# Altium project DTCP v1.2.PrjPcb
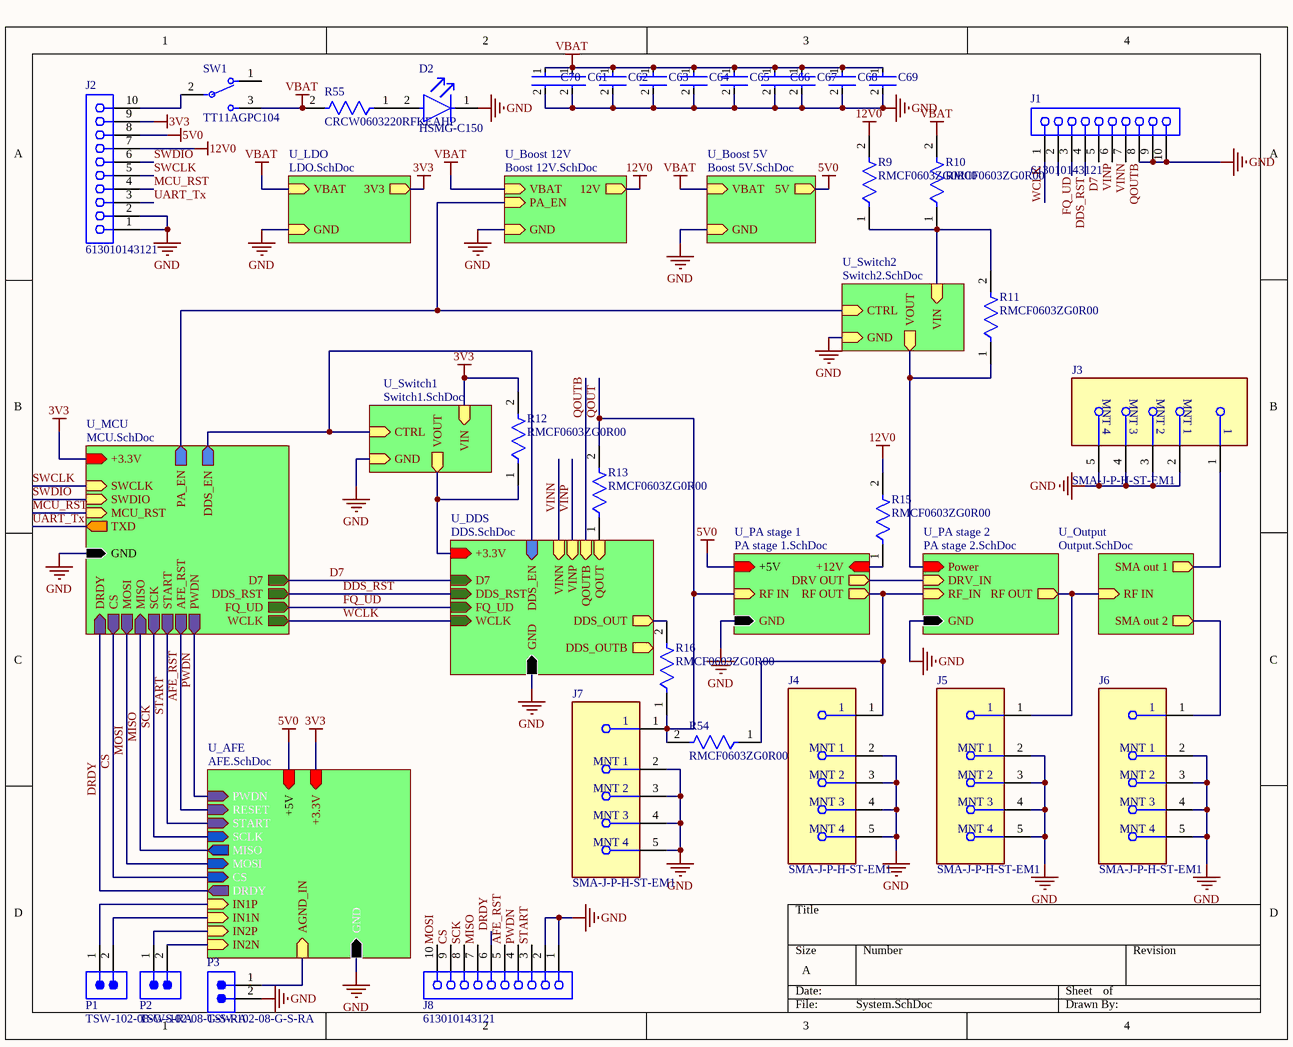
[diagram p0: System.SchDoc]
6 sheets, 92 parts. Net scope: hierarchical (ports join the sheet entries above them; power ports are global).
Board file: PCB1.PcbDoc
Sheets:
  System.SchDoc
    U_PA stage 1 = PA stage 1.SchDoc
    U_PA stage 2 = PA stage 2.SchDoc
    U_LDO = LDO.SchDoc
    U_Switch1 = Switch1.SchDoc
    U_Boost 5V = Boost 5V.SchDoc

## Sheet System.SchDoc
size A; SheetNumber: 1; SheetTotal: 12

### Parts
C61  GRM21BR60J107ME15K  [FP-GRM21B-0_2-e0_2_0_7-IPC_B]  (value not drawn)
C62  GRM21BR60J107ME15K  [FP-GRM21B-0_2-e0_2_0_7-IPC_B]  (value not drawn)
C63  GRM21BR60J107ME15K  [FP-GRM21B-0_2-e0_2_0_7-IPC_B]  (value not drawn)
C64  GRM21BR60J107ME15K  [FP-GRM21B-0_2-e0_2_0_7-IPC_B]  (value not drawn)
C65  GRM21BR60J107ME15K  [FP-GRM21B-0_2-e0_2_0_7-IPC_B]  (value not drawn)
C66  GRM21BR60J107ME15K  [FP-GRM21B-0_2-e0_2_0_7-IPC_B]  (value not drawn)
C67  GRM21BR60J107ME15K  [FP-GRM21B-0_2-e0_2_0_7-IPC_B]  (value not drawn)
C68  GRM21BR60J107ME15K  [FP-GRM21B-0_2-e0_2_0_7-IPC_B]  (value not drawn)
C69  GRM21BR60J107ME15K  [FP-GRM21B-0_2-e0_2_0_7-IPC_B]  (value not drawn)
C70  GRM21BR60J107ME15K  [FP-GRM21B-0_2-e0_2_0_7-IPC_B]  (value not drawn)
D2  HSMG-C150  [FP-HSMG-C150-MFG]
J1  613010143121  [613010143121]
J2  613010143121  [613010143121]
J3  SMA-J-P-H-ST-EM1  [FP-SMA-J-P-H-ST-EM1-MFG]
J4  SMA-J-P-H-ST-EM1  [FP-SMA-J-P-H-ST-EM1-MFG]
J5  SMA-J-P-H-ST-EM1  [FP-SMA-J-P-H-ST-EM1-MFG]
J6  SMA-J-P-H-ST-EM1  [FP-SMA-J-P-H-ST-EM1-MFG]
J7  SMA-J-P-H-ST-EM1  [FP-SMA-J-P-H-ST-EM1-MFG]
J8  613010143121  [613010143121]
P1  TSW-102-08-G-S-RA  [SMTC-TSW-102-08-X-S-RA]
P2  TSW-102-08-G-S-RA  [SMTC-TSW-102-08-X-S-RA]
P3  TSW-102-08-G-S-RA  [SMTC-TSW-102-08-X-S-RA]
R9  RMCF0603ZG0R00  [FP-RMCF0603-IPC_B]
R10  RMCF0603ZG0R00  [FP-RMCF0603-IPC_B]
R11  RMCF0603ZG0R00  [FP-RMCF0603-IPC_B]
R12  RMCF0603ZG0R00  [FP-RMCF0603-IPC_B]
R13  RMCF0603ZG0R00  [FP-RMCF0603-IPC_B]
R15  RMCF0603ZG0R00  [FP-RMCF0603-IPC_B]
R16  RMCF0603ZG0R00  [FP-RMCF0603-IPC_B]
R54  RMCF0603ZG0R00  [FP-RMCF0603-IPC_B]
R55  CRCW0603220RFKEAHP  [FP-CRCW0603-HPe3-IPC_A]
SW1  TT11AGPC104  [FP-TT11AGPC104-MFG]

### Sub-sheets
U_AFE = AFE.SchDoc (file not in this document): +5V (in), GND (in), +3.3V (in), DRDY (out), CS (in), SCLK (in), MISO (out), MOSI (in), START (in), PWDN (in), RESET (in), IN1P (in), IN1N (in), IN2P (in), IN2N (in), AGND_IN (in)
U_Boost 5V = Boost 5V.SchDoc: VBAT (in), GND (in), 5V (out)
U_Boost 12V = Boost 12V.SchDoc (file not in this document): VBAT (in), GND (in), 12V (out), PA_EN (in)
U_DDS = DDS.SchDoc (file not in this document): DDS_OUTB (out), DDS_OUT (out), D7 (in), DDS_RST (in), FQ_UD (in), WCLK (in), +3.3V (in), GND (in), DDS_EN (in), VINN (in), VINP (in), QOUTB (in), QOUT (in)
U_LDO = LDO.SchDoc: VBAT (in), GND (in), 3V3 (out)
U_MCU = MCU.SchDoc (file not in this document): +3.3V (in), GND (in), SWCLK (in), SWDIO (in), MCU_RST (in), TXD (out), CS (out), MOSI (out), MISO (in), SCK (out), D7 (out), DDS_RST (out), FQ_UD (out), WCLK (out), PWDN (out), START (out), AFE_RST (out), PA_EN (out), DDS_EN (out), DRDY (in)
U_Output = Output.SchDoc (file not in this document): RF IN (in), SMA out 1 (out), SMA out 2 (out)
U_PA stage 1 = PA stage 1.SchDoc: RF IN (in), RF OUT (out), +5V (in), GND (in), +12V (in), DRV OUT (out)
U_PA stage 2 = PA stage 2.SchDoc: GND (in), RF OUT (out), Power (in), RF_IN (in), DRV_IN (in)
U_Switch1 = Switch1.SchDoc: VIN (in), VOUT (out), CTRL (in), GND (in)
U_Switch2 = Switch2.SchDoc (file not in this document): VIN (in), VOUT (out), CTRL (in), GND (in)

### Nets
3V3: J2.9 R12.2 ; sheet U_MCU/+3.3V, sheet U_LDO/3V3, sheet U_Switch1/VIN, sheet U_AFE/+3.3V
5V0: J2.8 ; sheet U_PA stage 1/+5V, sheet U_Boost 5V/5V, sheet U_AFE/+5V
12V0: J2.7 R9.2 R15.2 ; sheet U_Boost 12V/12V
GND: C61.2 C62.2 C63.2 C64.2 C65.2 C66.2 C67.2 C68.2 C69.2 C70.2 D2.1(C) J1.8 J1.9 J1.10 J2.1 J2.2 J3.2(MNT_1) J3.3(MNT_2) J3.4(MNT_3) J3.5(MNT_4) J4.2(MNT_1) J4.3(MNT_2) J4.4(MNT_3) J4.5(MNT_4) J5.2(MNT_1) J5.3(MNT_2) J5.4(MNT_3) J5.5(MNT_4) J6.2(MNT_1) J6.3(MNT_2) J6.4(MNT_3) J6.5(MNT_4) J7.2(MNT_1) J7.3(MNT_2) J7.4(MNT_3) J7.5(MNT_4) J8.1 J8.2 P3.2 ; sheet U_MCU/GND, sheet U_DDS/GND, sheet U_PA stage 1/GND, sheet U_PA stage 2/GND, sheet U_LDO/GND, sheet U_Boost 12V/GND, sheet U_Switch1/GND, sheet U_Switch2/GND, sheet U_Boost 5V/GND, sheet U_AFE/GND
VBAT: C61.1 C62.1 C63.1 C64.1 C65.1 C66.1 C67.1 C68.1 C69.1 C70.1 R10.2 R55.2 SW1.3 ; sheet U_LDO/VBAT, sheet U_Boost 12V/VBAT, sheet U_Boost 5V/VBAT
AFE_RST: J8.5 ; sheet U_MCU/AFE_RST, sheet U_AFE/RESET
CS: J8.9 ; sheet U_MCU/CS, sheet U_AFE/CS
D7: J1.4 ; sheet U_MCU/D7, sheet U_DDS/D7
DDS_RST: J1.3 ; sheet U_MCU/DDS_RST, sheet U_DDS/DDS_RST
DRDY: J8.6 ; sheet U_MCU/DRDY, sheet U_AFE/DRDY
FQ_UD: J1.2 ; sheet U_MCU/FQ_UD, sheet U_DDS/FQ_UD
MCU_RST: J2.4 ; sheet U_MCU/MCU_RST
MISO: J8.7 ; sheet U_MCU/MISO, sheet U_AFE/MISO
MOSI: J8.10 ; sheet U_MCU/MOSI, sheet U_AFE/MOSI
PWDN: J8.4 ; sheet U_MCU/PWDN, sheet U_AFE/PWDN
QOUT: J7.1 R13.2 R16.1 R54.2 ; sheet U_PA stage 1/RF IN
QOUTB: J1.7 ; sheet U_DDS/QOUTB
SCK: J8.8 ; sheet U_MCU/SCK, sheet U_AFE/SCLK
START: J8.3 ; sheet U_MCU/START, sheet U_AFE/START
SWCLK: J2.5 ; sheet U_MCU/SWCLK
SWDIO: J2.6 ; sheet U_MCU/SWDIO
UART_Tx: J2.3 ; sheet U_MCU/TXD
VINN: J1.6 ; sheet U_DDS/VINN
VINP: J1.5 ; sheet U_DDS/VINP
WCLK: J1.1 ; sheet U_MCU/WCLK, sheet U_DDS/WCLK
NetC35_1: R15.1 ; sheet U_PA stage 1/+12V
NetD2_2: D2.2(A) R55.1
NetJ2_10: J2.10 SW1.2
NetJ3_1: J3.1 ; sheet U_Output/SMA out 1
NetJ4_1: J4.1 R54.1 ; sheet U_PA stage 1/RF OUT, sheet U_PA stage 2/RF_IN
NetJ5_1: J5.1 ; sheet U_PA stage 2/RF OUT, sheet U_Output/RF IN
NetJ6_1: J6.1 ; sheet U_Output/SMA out 2
NetP1_1: P1.1 ; sheet U_AFE/IN1P
NetP1_2: P1.2 ; sheet U_AFE/IN1N
NetP2_1: P2.1 ; sheet U_AFE/IN2P
NetP2_2: P2.2 ; sheet U_AFE/IN2N
NetP3_1: P3.1 ; sheet U_AFE/AGND_IN
NetQ1_2: sheet U_PA stage 1/DRV OUT, sheet U_PA stage 2/DRV_IN
NetR9_1: R9.1 R10.1 R11.2 ; sheet U_Switch2/VIN
NetR11_1: R11.1 ; sheet U_PA stage 2/Power, sheet U_Switch2/VOUT
NetR12_1: R12.1 ; sheet U_DDS/+3.3V, sheet U_Switch1/VOUT
NetR13_1: R13.1 ; sheet U_DDS/QOUT
NetR16_2: R16.2 ; sheet U_DDS/DDS_OUT
NetU3_3: sheet U_MCU/DDS_EN, sheet U_DDS/DDS_EN, sheet U_Switch1/CTRL
(unnamed): sheet U_MCU/PA_EN, sheet U_Boost 12V/PA_EN, sheet U_Switch2/CTRL

Not connected (* = marked no-connect by the designer): SW1 1

### Library data of the parts
C61-C70 = CMP-06035-052658-1: Chip Multilayer Ceramic Capacitors for General Purpose, 0805, 100uF, X5R, 15%, 20%, 6.3V; Voltage Rating (DC): 6.3V; Lead Free: Lead Free; Length: 2mm; Tolerance: 20%; Width: 1.25mm; Capacitance: 100uF; Dielectric: X5R; Thickness: 1.25mm
D2 = CMP-2000-05061-2: LED GREEN DIFFUSED 1206 SMD; Manufacturer: Broadcom; Led Orientation: Top View; Max Junction Temp: +95°C; Peak Emmision Wavelength: 570nm; Viewing Angle: 170°; Wavelength: 572nm; Reverse Voltage: 5V; Luminous Intensity: 15mcd; Forward Voltage: 2.2V; Power Dissipation: 65mW; Forward Current: 20mA; ComponentLink2Description: Datasheet; Lead Free: Yes; Temperature Range Low: -40°C; Package: HSMG-C150; Digikey Description: LED GREEN DIFFUSED 1206 SMD; Mouser Description: LED Uni-Color Green 570nm 2-Pin Chip LED T/R; Manufacturer Part Number: HSMG-C150; Temperature Range High: +85°C; Device Class L1: Optoelectronics; Colour: Green; Category: Diode; Device Class L3: unset; RoHS: TRUE; Height: 1.2mm; ComponentLink2URL: https://docs.broadcom.com/docs/AV02-0551EN; Device Class L2: LEDs; Automotive: No; Ipc Land Pattern Name: DIOCP320160X55; Octopart: https://octopart.com/hsmg-c150-broadcom-71131304; Temperature: -40°C to +85°C
J1 J2 J8 = CMP-1502-01419-3: NexarPartId: 18818161; Operating Supply Voltage: 250V; Contact Resistance: 20mΩ; Gender: Female; Insulation Resistance: 1GΩ; Connector Type: Header, Socket; Insulation: Insulated; Current Rating: 3A; Number of Positions: 10; Pitch: 2.54mm; Number of Rows: 1; Number of Pins: 10; Voltage Rating: 250V; Length: 25.9mm; Contact Gender: Female; RoHS: Compliant; Contact Plating: Gold; Height: 8.5mm; Min Operating Temperature: -40°C; Contact Material: Copper; Number of Contacts: 10; REACH SVHC: Unknown; Mount: Through Hole; Lead Pitch: 2.54mm; Width: 25.9mm; Max Operating Temperature: 125°C; Flammability Rating: UL94 V-0; Termination: Through Hole; Color: Black; Housing Material: PBT
J3-J7 = CMP-02754-000006-1: CONN SMA JACK STR 50OHM EDGE MNT; Dielectric Material: PTFE; Center Contact Plating: Gold; Max Frequency: 6GHz; Body Material: Brass; Voltage Rating: 335V; Impedance: 50R; Package Quantity: 1; Case/Package: SMA; Max Operating Temperature: 125°C; Fastening Type: Threaded; Orientation: Straight; Depth: 13.33mm; RoHS Compliant: Yes; Length: 6.35mm; Insulation Material: Polytetrafluoroethylene; Termination: Solder; Min Operating Temperature: -65°C; Housing Color: Gold; Contact Plating: Gold; Contact Material: Copper; Connector Type: SMA; Mount: Edge; Series: SMA; Packaging: Tray; Body Plating: Gold; Radiation Hardening: No
P1-P3 = CMP-1024-00320-1: 0.025" SQ Post Header, Through-hole, Right Angle, -55 to 125 degC, 2.54 mm Pitch, 2-Pin, Male, RoHS; Manufacturer: Samtec; Pitch: 2.54 mm; Temperature Range: -55 to 125 degC; PackageDescription: .025[0.64] SQ. Post Terminal Strip Assembly; ComponentLink3Description: Package Specification; ComponentLink2Description: Datasheet; PackageReference: TSW-102-08-X-S-RA; ComponentLink1Description: Manufacturer URL; ComponentLink2URL: http://www.samtec.com/documents/webfiles/pdf/TSW_TH.PDF; PackageVersion: DM, 8/1988; RoHS: True; PartNumber: TSW-102-08-G-S-RA; Mounting Technology: Through-hole; Orientation: Right Angle; ComponentLink1URL: http://www.samtec.com; DatasheetVersion: F-214; ComponentLink3URL: http://www.samtec.com/documents/webfiles/cpdf/TSW-XXX-XX-XXX-X-XX-XXX-MKT.pdf
R9-R13 R15 R16 R54 = CMP-26527-006412-1: 0Ω ±0 0.1W 0603 Thick Film Chip Resistor AEC-Q200 compliant; Max Power Dissipation: 100mW; Resistance: 0R; Width: 0.031inch; RoHS Compliant: Yes; Number of Terminations: 2; Case/Package: 0603; Contact Plating: Tin; Height: 0.022inch; Resistor Type: Thick Film; Mount: Surface Mount; Length: 0.061inch; Features: Automotive AEC-Q200; Series: RMCF; Max Operating Temperature: 155°C; Radiation Hardening: No; Min Operating Temperature: -55°C; Packaging: Tape and Reel
R55 = CMP-02407-003593-1: RES Thick Film, 220Ω, 1%, 0.33W, 100ppm/°C, 0603; Max Power Dissipation: 250mW; Voltage Rating (DC): 75V; Resistance: 220R; Radiation Hardening: No; Contact Plating: Tin; Length: 1.6mm; Depth: 0.85mm; Composition: Thick Film; Lead Free: Lead Free; Mount: Surface Mount; Package Quantity: 5000; Height: 0.45mm; Termination: SMD/SMT; Weight: 7.1E-05oz; Military Standard: Not; Number of Terminations: 2; Case Code (Metric): 1608; Max Operating Temperature: 155°C; Power Rating: 250mW; Tolerance: 1%; Temperature Coefficient: 100ppm/°C; Features: Automotive AEC-Q200; Case Code (Imperial): 0603; Width: 0.033inch; Min Operating Temperature: -55°C; Case/Package: 0603; Voltage Rating: 75V; Packaging: Tape and Reel
SW1 = CMP-03408-000020-1: SWITCH TOGGLE SPST 0.4VA 20V; Illumination Type: Illuminated; Actuator Length: 5.61mm; Contact Current Rating: 3A; Power Rating: 400mW; Voltage Rating (AC): 20V; Packaging: Bulk; Max Voltage Rating (DC): 20V; Actuator Type: Toggle; Orientation: Straight; RoHS Compliant: Yes; Throw Configuration: SPST; Min Operating Temperature: -30°C; Voltage Rating (DC): 20V; Series: TT (Tiny); Contact Plating: Gold; Package Quantity: 25; Max Operating Temperature: 85°C; Mount: Brackets; Termination: PC Pins; Max Voltage Rating (AC): 20V

## Sheet PA stage 1.SchDoc
size A; SheetNumber: 8; SheetTotal: 12
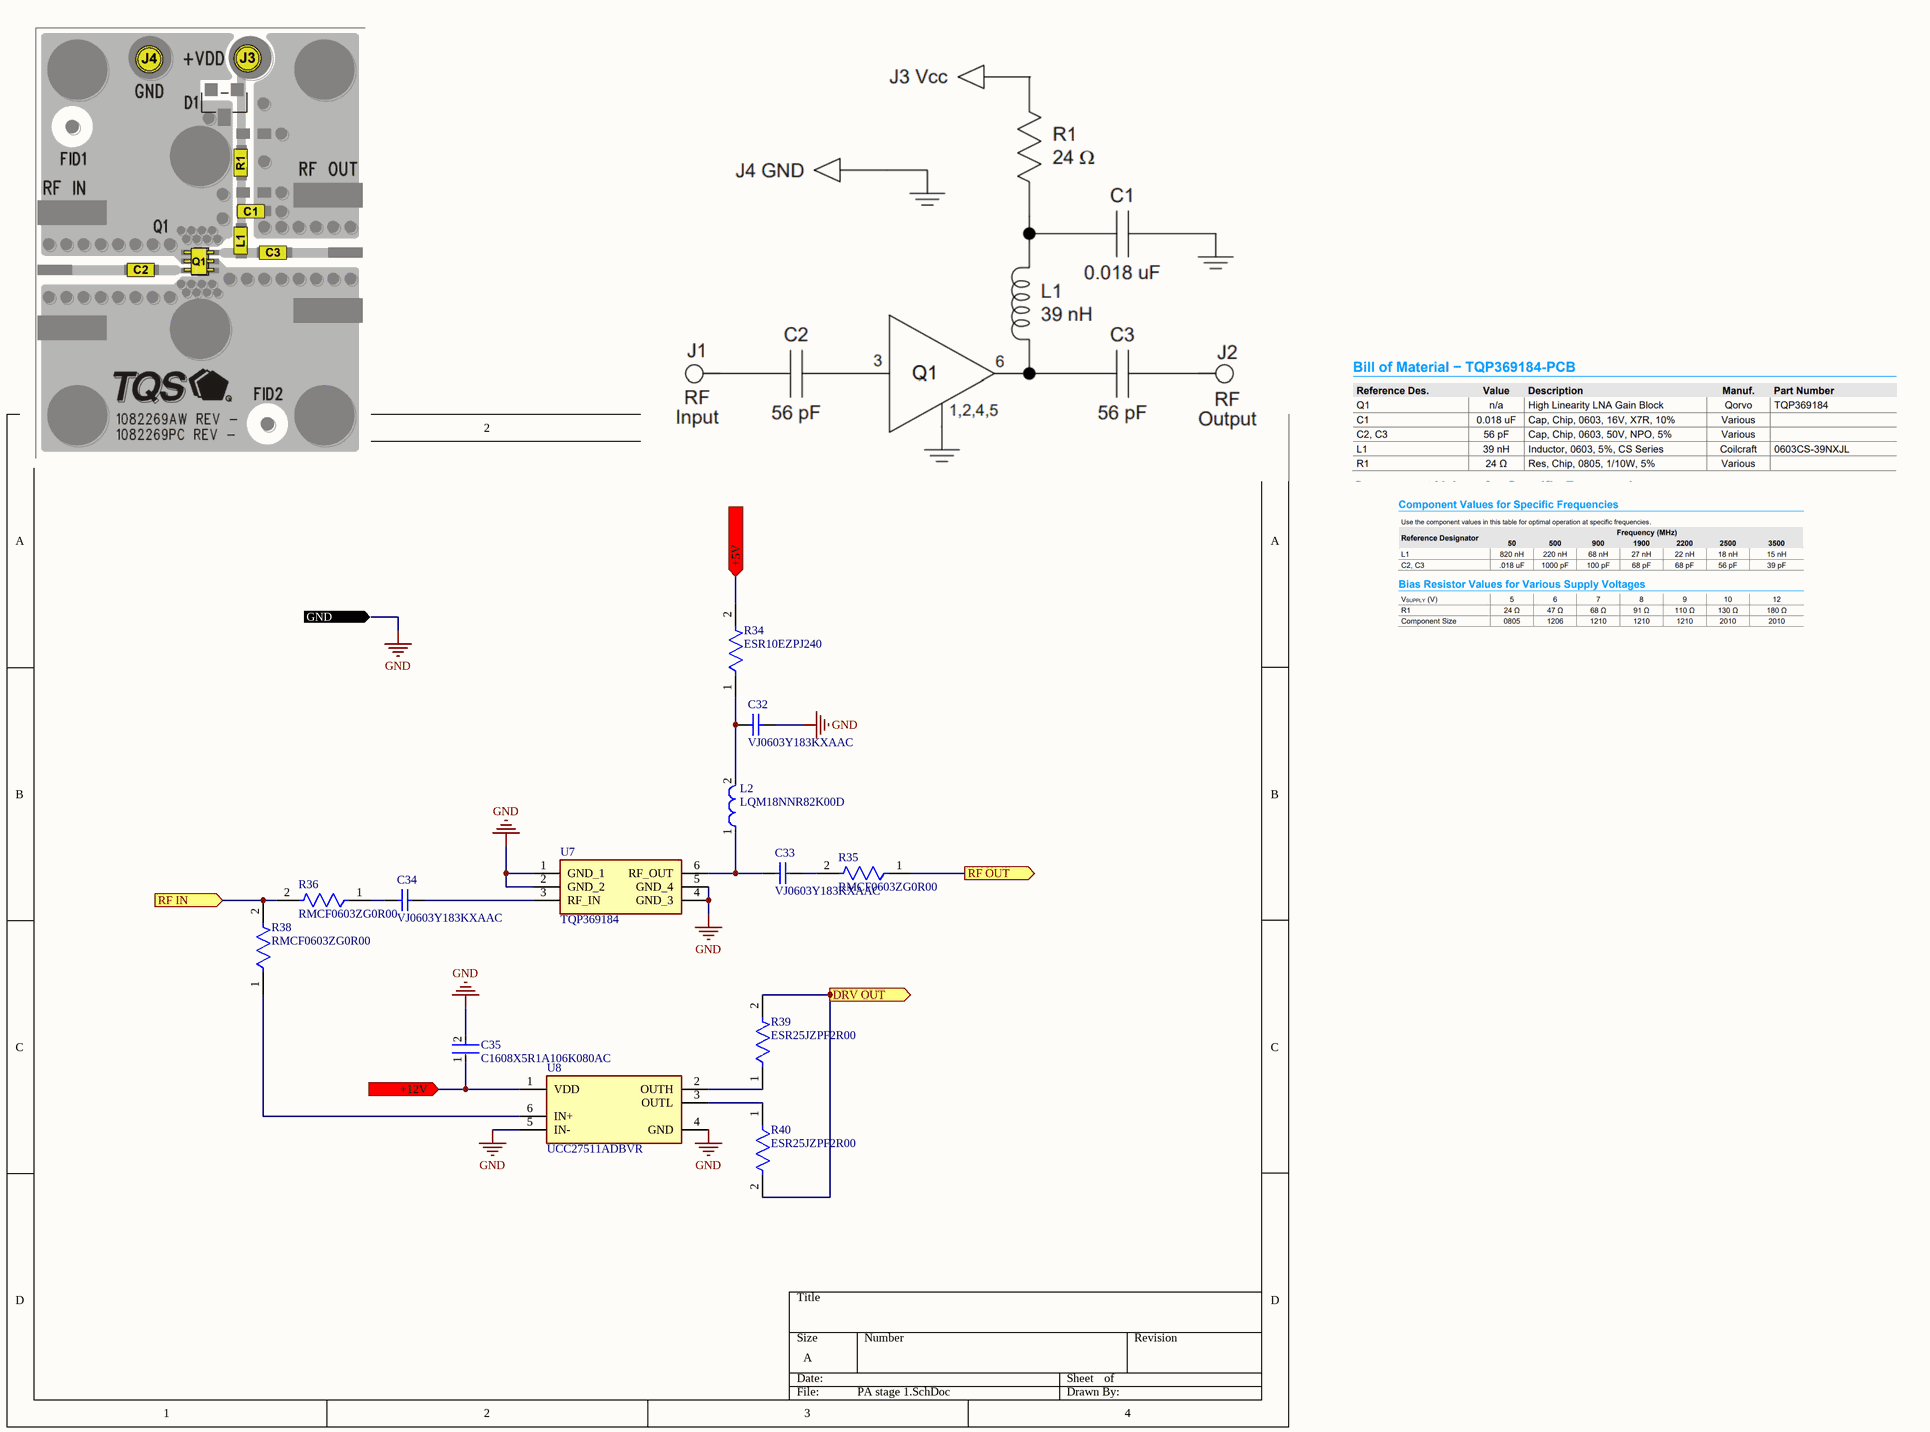
[diagram p1: PA stage 1.SchDoc]

### Parts
C32  VJ0603Y183KXAAC  [CAPC1608X92X38ML15T08]
C33  VJ0603Y183KXAAC  [CAPC1608X92X38ML15T08]
C34  VJ0603Y183KXAAC  [CAPC1608X92X38ML15T08]
C35  C1608X5R1A106K080AC  [FP-C1608-080-0_1-MFG]
L2  LQM18NNR82K00D  [FP-LQM18NN_00-IPC_B]
R34  ESR10EZPJ240  [FP-ESR10-IPC_C]
R35  RMCF0603ZG0R00  [FP-RMCF0603-IPC_B]
R36  RMCF0603ZG0R00  [FP-RMCF0603-IPC_B]
R38  RMCF0603ZG0R00  [FP-RMCF0603-IPC_B]
R39  ESR25JZPF2R00  [FP-ESR25-MFG]
R40  ESR25JZPF2R00  [FP-ESR25-MFG]
U7  TQP369184  [SOT65P210X110-6N]
U8  UCC27511ADBVR  [FP-DBV0006A-IPC_B]

### Ports
+5V (in), +12V (in), DRV OUT (out), GND (in), RF IN (in), RF OUT (out)

### Nets
5V0: R34.2 ; port +5V
GND: C32.2 C35.2 U7.1(GND_1) U7.2(GND_2) U7.4(GND_3) U7.5(GND_4) U8.4(GND) U8.5(IN-) ; port GND
QOUT: R36.2 R38.2 ; port RF IN
NetC32_1: C32.1 L2.2 R34.1
NetC33_1: C33.1 L2.1 U7.6(RF_OUT)
NetC33_2: C33.2 R35.2
NetC34_1: C34.1 R36.1
NetC34_2: C34.2 U7.3(RF_IN)
NetC35_1: C35.1 U8.1(VDD) ; port +12V
NetJ4_1: R35.1 ; port RF OUT
NetQ1_2: R39.2 R40.2 ; port DRV OUT
NetR38_1: R38.1 U8.6(IN+)
NetR39_1: R39.1 U8.2(OUTH)
NetR40_1: R40.1 U8.3(OUTL)

### Library data of the parts
C32-C34 = CMP-2006-01326-1: Manufacturer: Vitramon; Part Number: VJ0603Y183KXAAC
C35 = CMP-2000-04979-3: Multilayer Ceramic Capacitors 10μF ±10% 10V X5R SMD 0603; Capacitance: 10uF; Dielectric Material: Ceramic; Construction: Flat; Height: 0.8mm; Thickness: 0.035inch; Case Code (Metric): 1608; Radiation Hardening: No; Number of Pins: 2; Voltage Rating (DC): 10V; Depth: 0.8mm; Voltage: 10V; RoHS Compliant: Yes; Voltage Rating: 10V; Package Quantity: 1; Resistor Type: Ceramic; Termination: SMD/SMT; Lead Free: Lead Free; REACH SVHC: No SVHC; Tolerance: 10%; Mount: Surface Mount; Series: C; Packaging: Tape and Reel; Width: 0.8mm; Dielectric: X5R; Weight: 7.1E-05oz; Length: 1.6mm; Max Operating Temperature: 85°C; Case Code (Imperial): 0603; Case/Package: 0603; Min Operating Temperature: -55°C
L2 = CMP-06042-016197-1: Multilayer Type Inductor for General Circuits, 0603 (1608), 820nH, 10%, 2.1Ω, 35mA; Self Resonant Frequency: 85MHz; Shielding: Shielded; DC Resistance (DCR): 2.1R; Test Frequency: 25MHz; Core Material: Ferrite; Q Factor: 15; RoHS Compliant: Yes; Length: 1.6mm; Max Operating Temperature: 85°C; Case Code (Metric): 1608; Lead Free: Lead Free; Package Quantity: 1; Series: LQM18N; Height - Seated (Max): 0.037inch; Current Rating: 35mA; Radiation Hardening: No; REACH SVHC: No SVHC; Termination: SMD/SMT; Case Code (Imperial): 0603; Width: 0.031inch; Height: 0.8mm; Tolerance: 10%; Military Standard: Not; Mount: Surface Mount; Max DC Current: 35mA; Depth: 0.95mm; Inductance: 820nH; Min Operating Temperature: -40°C; DC Current: 35mA; Case/Package: 0603; Packaging: Tape and Reel
R34 = CMP-08839-028611-1: 24Ω ±5% 0.4W 0805 Anti-Surge Chip Resistor AEC-Q200; Temperature Coefficient: 200ppm/°C; Resistance: 24R; Max Power Dissipation: 400mW; Tolerance: 5%; RoHS Compliant: Yes; Max Operating Temperature: 155°C; Min Operating Temperature: -55°C; Resistor Type: Thick Film; Width: 0.049inch; Length: 0.079inch; Number of Terminations: 2; Height: 0.026inch; Case Code (Imperial): 0805; Series: ESR; Case/Package: 0805; Case Code (Metric): 2012; Packaging: Tape and Reel; Features: Automotive AEC-Q200; Package Quantity: 1
R35 R36 R38 = CMP-26527-006412-1: as R9 on sheet System; Width: 0.031inch; RoHS Compliant: Yes; Number of Terminations: 2; Case/Package: 0603; Contact Plating: Tin; Height: 0.022inch; Resistor Type: Thick Film; Mount: Surface Mount; Length: 0.061inch; Features: Automotive AEC-Q200; Series: RMCF; Max Operating Temperature: 155°C; Radiation Hardening: No; Min Operating Temperature: -55°C; Packaging: Tape and Reel
R39 R40 = CMP-08839-008954-1: 2Ω ±1% 0.66W 1210 Anti-Surge Chip Resistor AEC-Q200; Temperature Coefficient: 100ppm/°C; Resistance: 2R; Power Rating: 500mW; Series: ESR; RoHS Compliant: Yes; Number of Terminations: 2; Length: 0.126inch; Case/Package: 1210; Min Operating Temperature: -55°C; Width: 0.098inch; Lead Free: Lead Free; Packaging: Tape and Reel; Features: Automotive AEC-Q200; Height: 0.026inch; Case Code (Imperial): 1210; Case Code (Metric): 3225; Size Code: 1210; Package Quantity: 1; Max Operating Temperature: 155°C; Resistor Type: Thick Film; Max Power Dissipation: 500mW; Tolerance: 1%
U7 = TQP369184: DC  6 GHz Gain Block; Manufacturer_Name: Qorvo; Geometry.Height: 1.1mm; Mouser Part Number: 772-TQP369184; Mouser Price/Stock: https://www.mouser.co.uk/ProductDetail/Qorvo/TQP369184?qs=opBjA1TV900HByuIeJCWsQ%3D%3D; Manufacturer_Part_Number: TQP369184; Datasheet Link: https://www.qorvo.com/products/d/da005471
U8 = CMP-04912-000035-1: IC GATE DRVR LOW-SIDE SOT23-6; Number of Drivers: 1; Max Output Current: 8A; Channel Type: Single; Case/Package: SOT-23-6; Mount: Surface Mount; Max Operating Temperature: 140°C; Packaging: Tape and Reel; Min Operating Temperature: -40°C; RoHS Compliant: Yes; Number of Channels: 1

## Sheet PA stage 2.SchDoc
size A; SheetNumber: 9; SheetTotal: 12
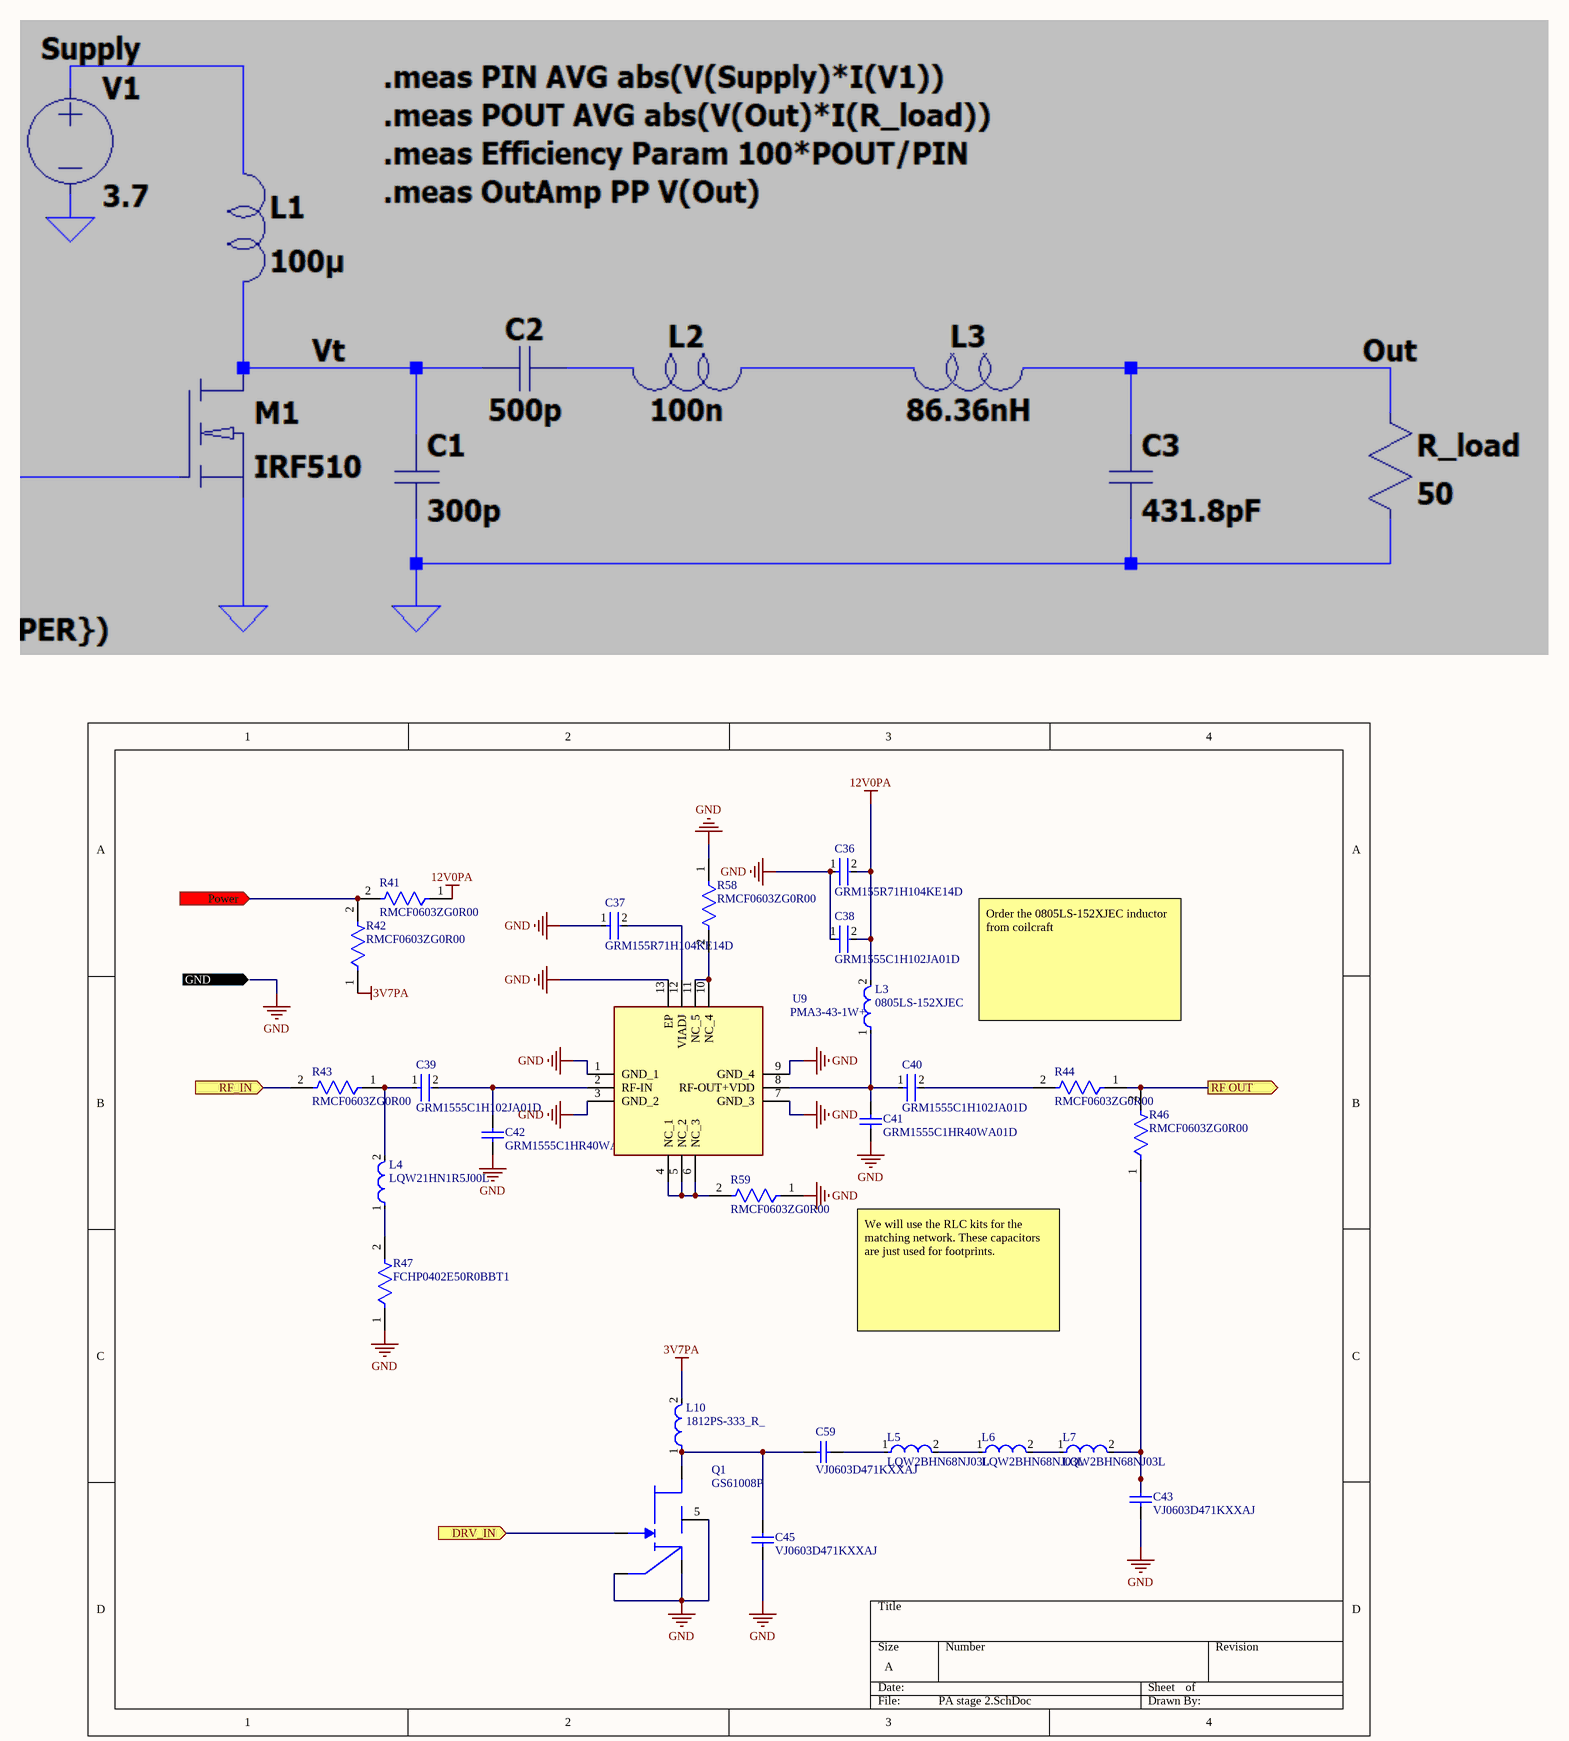
[diagram p2: PA stage 2.SchDoc]

### Parts
C36  GRM155R71H104KE14D  [FP-GRM155-0_05-IPC_B]
C37  GRM155R71H104KE14D  [FP-GRM155-0_05-IPC_B]
C38  GRM1555C1H102JA01D  [FP-GRM155-0_05-IPC_B]
C39  GRM1555C1H102JA01D  [FP-GRM155-0_05-IPC_B]
C40  GRM1555C1H102JA01D  [FP-GRM155-0_05-IPC_B]
C41  GRM1555C1HR40WA01D  [CAPC1005X55X25LL05T10]
C42  GRM1555C1HR40WA01D  [CAPC1005X55X25LL05T10]
C43  VJ0603D471KXXAJ  [CAPC1608X92X38LL15T08]
C45  VJ0603D471KXXAJ  [CAPC1608X92X38LL15T08]
C59  VJ0603D471KXXAJ  [CAPC1608X92X38LL15T08]
L3  0805LS-152XJEC  [FP-LQW21HN_00-MFG]
L4  LQW21HN1R5J00L  [FP-LQW21HN_00-MFG]
L5  LQW2BHN68NJ03L  [FP-LQW2BHN_03-MFG]
L6  LQW2BHN68NJ03L  [FP-LQW2BHN_03-MFG]
L7  LQW2BHN68NJ03L  [FP-LQW2BHN_03-MFG]
L10  1812PS-333_R_  [FP-1812PS-MFG]
Q1  GS61008P  [TRANS_GS61008P]
R41  RMCF0603ZG0R00  [FP-RMCF0603-IPC_B]
R42  RMCF0603ZG0R00  [FP-RMCF0603-IPC_B]
R43  RMCF0603ZG0R00  [FP-RMCF0603-IPC_B]
R44  RMCF0603ZG0R00  [FP-RMCF0603-IPC_B]
R46  RMCF0603ZG0R00  [FP-RMCF0603-IPC_B]
R47  FCHP0402E50R0BBT1  [FP-FC0402-MFG]
R58  RMCF0603ZG0R00  [FP-RMCF0603-IPC_B]
R59  RMCF0603ZG0R00  [FP-RMCF0603-IPC_B]
U9  PMA3-43-1W+  [QFN51P300X300X89-13N]

### Ports
DRV_IN (in), GND (in), Power (in), RF OUT (out), RF_IN (in)

### Nets
3V7PA: L10.2 R42.1
12V0PA: C36.2 C38.2 L3.2 R41.1
GND: C36.1 C37.1 C38.1 C41.1 C42.1 C43.1 C45.1 Q1.3(SS) Q1.4(S) Q1.5(THERMAL_PAD) R47.1 R58.1 R59.1 U9.1(GND_1) U9.3(GND_2) U9.7(GND_3) U9.9(GND_4) U9.13(EP) ; port GND
NetC37_2: C37.2 U9.12(VIADJ)
NetC39_1: C39.1 L4.2 R43.1
NetC39_2: C39.2 C42.2 U9.2(RF-IN)
NetC40_1: C40.1 C41.2 L3.1 U9.8(RF-OUT+VDD)
NetC40_2: C40.2 R44.2
NetC43_2: C43.2 L7.2 R46.1
NetC45_2: C45.2 C59.2 L10.1 Q1.1(D)
NetC59_1: C59.1 L5.1
NetJ4_1: R43.2 ; port RF_IN
NetJ5_1: R44.1 R46.2 ; port RF OUT
NetL4_1: L4.1 R47.2
NetL5_2: L5.2 L6.1
NetL6_2: L6.2 L7.1
NetQ1_2: Q1.2(G) ; port DRV_IN
NetR11_1: R41.2 R42.2 ; port Power
NetR58_2: R58.2 U9.10(NC_4) U9.11(NC_5)
NetR59_2: R59.2 U9.4(NC_1) U9.5(NC_2) U9.6(NC_3)

### Notes on the sheet
- Order the 0805LS-152XJEC inductor from coilcraft
- We will use the RLC kits for the matching network. These capacitors are just used for footprints.

### Library data of the parts
C36 C37 = CMP-2008-04639-2: Chip Multilayer Ceramic Capacitors for General Purpose, 0402, 0.10uF, X7R, 15%, 10%, 50V; Dissipation Factor: 0.025%; Capacitance: 100nF; Weight: 0.000212oz; Thickness: 0.022inch; Voltage Rating (DC): 50V; Dielectric Material: Ceramic; Termination: SMD/SMT; Case/Package: 0402; Case Code (Imperial): 0402; Mount: Surface Mount; REACH SVHC: No SVHC; Resistor Type: Ceramic; Dielectric: X7R; Max Operating Temperature: 125°C; Voltage: 50V; Lead Free: Lead Free; Package Quantity: 10000; Packaging: Tape and Reel; Length: 1mm; Material: Ceramic; Height: 0.5mm; Depth: 0.5mm; Width: 0.5mm; Min Operating Temperature: -55°C; Tolerance: 10%; Case Code (Metric): 1005; Voltage Rating: 50V
C38-C40 = CMP-2008-04254-2: Chip Multilayer Ceramic Capacitors for General Purpose, 0402, 1000pF, C0G, 30ppm/°C, 5%, 50V; Insulation Resistance: 10GR; Capacitance: 1nF; Packaging: Tape and Reel; Lead Free: Lead Free; Tolerance: 5%; Temperature Coefficient: 30ppm/°C; Thickness: 0.022inch; Termination: SMD/SMT; Max Operating Temperature: 125°C; Height: 0.5mm; Package Quantity: 1; Radiation Hardening: No; Material: Ceramic; Case Code (Metric): 1005; Number of Pins: 2; Voltage Rating: 50V; Mount: Surface Mount; Voltage: 50V; Case/Package: 0402; Min Operating Temperature: -55°C; Dielectric Material: Ceramic; Width: 0.5mm; Depth: 0.5mm; Case Code (Imperial): 0402; REACH SVHC: No SVHC; Dielectric: C0G; Voltage Rating (DC): 50V; Length: 1mm
C41 C42 = CMP-1034-00010-2: Manufacturer: Murata; Part Number: GRM1555C1HR40WA01D
C43 C45 C59 = CMP-2006-01521-1: Manufacturer: Vitramon; Part Number: VJ0603D471KXXAJ
L3 = CMP-06042-001639-1: 0805LS-152XJEC Coilcraft; Core Material: Ferrite; DC Current: 85mA; DC Resistance (DCR): 5.33R; Self Resonant Frequency: 350MHz; Shielding: Unshielded; Inductance: 1.5uH; Test Frequency: 10MHz; Tolerance: 5%; Q Factor: 35; Width: 0.047inch; Case Code (Metric): 2012; Current Rating: 85mA; Mount: Surface Mount; Max DC Current: 85mA; Length: 2mm; Height - Seated (Max): 0.039inch; Depth: 1.4mm; Min Operating Temperature: -40°C; Termination: SMD/SMT; Military Standard: Not; Radiation Hardening: No; Packaging: Tape and Reel; Resistor Type: Wirewound; Case/Package: 0805; Case Code (Imperial): 0805; Weight: 0.000282oz; Height: 0.9mm; Package Quantity: 3000; Max Operating Temperature: 85°C
L4 = CMP-06042-001639-1: Wire Wound Ferrite type RF Inuctor 1.5uH ±5% 85mA 5.33Ω 0805 (2012); DC Resistance (DCR): 5.33R; Self Resonant Frequency: 350MHz; Shielding: Unshielded; Test Frequency: 10MHz; Q Factor: 35; Width: 0.047inch; Core Material: Ferrite; Case Code (Metric): 2012; DC Current: 85mA; Current Rating: 85mA; Mount: Surface Mount; Max DC Current: 85mA; Length: 2mm; Height - Seated (Max): 0.039inch; Depth: 1.4mm; Min Operating Temperature: -40°C; Termination: SMD/SMT; Military Standard: Not; Radiation Hardening: No; Packaging: Tape and Reel; Resistor Type: Wirewound; Case/Package: 0805; Case Code (Imperial): 0805; Inductance: 1.5uH; Weight: 0.000282oz; Height: 0.9mm; Package Quantity: 3000; Max Operating Temperature: 85°C; Tolerance: 5%
L5-L7 = CMP-06042-008671-1: Wire Wound RF Inductor 68nH ±5% 460mA 0.23Ω 0805 (2015); Shielding: Unshielded; DC Resistance (DCR): 230mR; Q Factor: 40; Test Frequency: 100MHz; Self Resonant Frequency: 1.2GHz; Core Material: Non-Magnetic; Depth: 1.7mm; Height - Seated (Max): 0.07inch; Case/Package: 0805; Min Operating Temperature: -40°C; Package Quantity: 2000; Weight: 0.000317oz; Max Operating Temperature: 85°C; Width: 0.059inch; Length: 2.2mm; DC Current: 460mA; Current Rating: 460mA; Radiation Hardening: No; Termination: SMD/SMT; Case Code (Metric): 2015; Max DC Current: 460mA; Mount: Surface Mount; Military Standard: Not; Inductance: 68nH; Tolerance: 5%; Packaging: Tape and Reel; Resistor Type: Wirewound; Height: 1.7mm; Case Code (Imperial): 0805
L10 = CMP-11268-000188-1: 1812PS-333_R_ Coilcraft; Core Material: Ferrite; Test Frequency: 100kHz; DC Resistance (DCR): 170mR; Inductance: 10uH; Self Resonant Frequency: 120MHz; Q Factor: 40; Shielding: Shielded; Tolerance: 5%; Max DC Current: 1.7A; Height: 3.81mm; Length: 5.87mm; Case/Package: 1812; Series: 1812PS; Packaging: Tape and Reel; Package Quantity: 600; Width: 4.98mm; Max Operating Temperature: 105°C; Termination: SMD/SMT; Lead Free: Contains Lead; Min Operating Temperature: -40°C; RoHS Compliant: Yes
Q1 = GS61008P: Top cooled 100V enhancement mode GaN transistor; MF: GaN Systems; Check_prices: https://www.snapeda.com/parts/GS61008P/GaN%20Systems/view-part/106624/?ref=eda; Availability: In Stock; Price: None; Package: DFN-5 GaN Systems; Value: *; SnapEDA_Link: https://www.snapeda.com/parts/GS61008P/GaN%20Systems/view-part/106624/?ref=snap; Purchase-URL: https://pricing.snapeda.com/search/part/GS61008P/?ref=eda; MP: GS61008P
R41-R44 R46 R58 R59 = CMP-26527-006412-1: as R9 on sheet System; Width: 0.031inch; RoHS Compliant: Yes; Number of Terminations: 2; Case/Package: 0603; Contact Plating: Tin; Height: 0.022inch; Resistor Type: Thick Film; Mount: Surface Mount; Length: 0.061inch; Features: Automotive AEC-Q200; Series: RMCF; Max Operating Temperature: 155°C; Radiation Hardening: No; Min Operating Temperature: -55°C; Packaging: Tape and Reel
R47 = CMP-05494-120702529-1: FCHP0402E50R0BBT1 SMD Chip Resistor, 50 Ohm, ± 0.1%, 1 W, 0402 [1005 Metric], Thin Film, High Frequency; Power Rating: 1W; Voltage Rating: 30V; Temperature Coefficient: 25ppm/°C; Resistance: 50Ω; Max Operating Temperature: 155°C; Min Operating Temperature: -55°C; Composition: Thin Film; Schedule B: 8533210045; Case/Package: 0402; Tolerance: 0.1%; Height: 419.1µm; NexarPartId: 120702529
U9 = PMA3-43-1W+: Integrated Circuit; Manufacturer_Name: Mini-Circuits; Datasheet Link: https://www.minicircuits.com/pdfs/PMA3-43-1W+.pdf; Height: 0.89mm; Manufacturer_Part_Number: PMA3-43-1W+

## Sheet LDO.SchDoc
size A; SheetNumber: 6; SheetTotal: 12
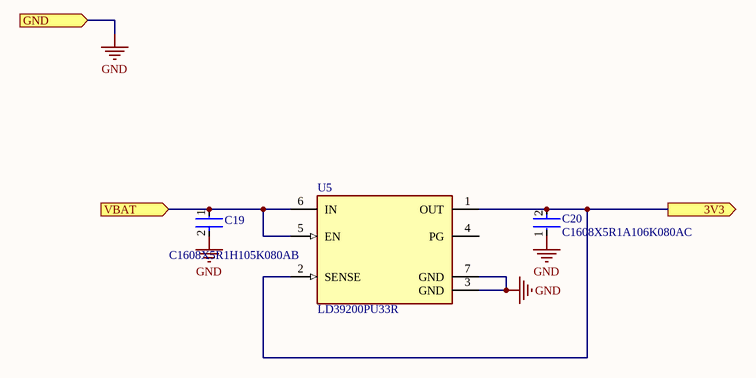
[diagram p3: LDO.SchDoc]

### Parts
C19  C1608X5R1H105K080AB  [FP-C1608-080-0_1-IPC_B]
C20  C1608X5R1A106K080AC  [FP-C1608-080-0_1-MFG]
U5  LD39200PU33R  [FP-DFN6-7946637-MFG]

### Ports
3V3 (out), GND (in), VBAT (in)

### Nets
3V3: C20.2 U5.1(OUT) U5.2(SENSE) ; port 3V3
GND: C19.2 C20.1 U5.3(GND) U5.7(GND) ; port GND
VBAT: C19.1 U5.5(EN) U5.6(IN) ; port VBAT

Not connected (* = marked no-connect by the designer): U5 4(PG)

### Library data of the parts
C19 = CMP-2000-06025-2: Multilayer Ceramic Capacitors 1μF ±10% 50V X5R SMD 0603; Capacitance: 1uF; Lead Free: Lead Free; Height: 0.8mm; Mount: Surface Mount; Radiation Hardening: No; Thickness: 0.035inch; Length: 1.6mm; Max Operating Temperature: 85°C; REACH SVHC: No SVHC; Min Operating Temperature: -55°C; Construction: Flat; RoHS Compliant: Yes; Voltage Rating: 50V; Dielectric: X5R; Packaging: Tape and Reel; Termination: SMD/SMT; Voltage Rating (DC): 50V; Case Code (Imperial): 0603; Voltage: 50V; Width: 0.031inch; Weight: 7.1E-05oz; Depth: 0.8mm; Case Code (Metric): 1608; Series: C; Case/Package: 0603; Tolerance: 10%; Resistor Type: Ceramic; Number of Pins: 2; Dielectric Material: Ceramic; Package Quantity: 1
C20 = CMP-2000-04979-3: as C35 on sheet PA stage 1; Dielectric Material: Ceramic; Construction: Flat; Height: 0.8mm; Thickness: 0.035inch; Case Code (Metric): 1608; Radiation Hardening: No; Number of Pins: 2; Voltage Rating (DC): 10V; Depth: 0.8mm; Voltage: 10V; RoHS Compliant: Yes; Voltage Rating: 10V; Package Quantity: 1; Resistor Type: Ceramic; Termination: SMD/SMT; Lead Free: Lead Free; REACH SVHC: No SVHC; Tolerance: 10%; Mount: Surface Mount; Series: C; Packaging: Tape and Reel; Width: 0.8mm; Dielectric: X5R; Weight: 7.1E-05oz; Length: 1.6mm; Max Operating Temperature: 85°C; Case Code (Imperial): 0603; Case/Package: 0603; Min Operating Temperature: -55°C
U5 = CMP-12153-000011-1: IC REG LINEAR 3.3V 2A 6DFN; Number of Outputs: 1; Max Input Voltage: 6V; Output Type: Fixed; Min Input Voltage: 1.25V; Dropout Voltage: 130mV; Operating Supply Current: 1mA; Number of Regulators: 1; Case/Package: DFN; Packaging: Tape and Reel; Output Current: 2A; Min Operating Temperature: -40°C; Mount: Surface Mount; Output Voltage: 3.3V; Max Operating Temperature: 125°C; Lead Free: Lead Free; Package Quantity: 3000

## Sheet Switch1.SchDoc
size A; SheetNumber: 4; SheetTotal: 12
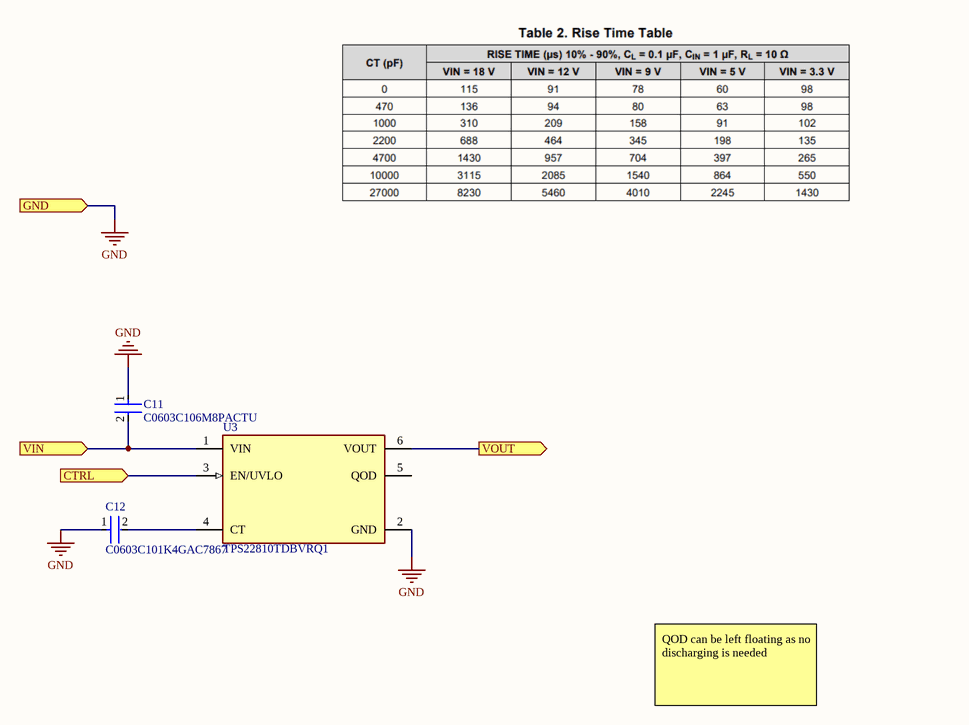
[diagram p4: Switch1.SchDoc]

### Parts
C11  C0603C106M8PACTU  [FP-C0603C106M8PACTU-MFG]
C12  C0603C101K4GAC7867  [FP-C0603C-CF-MFG]
U3  TPS22810TDBVRQ1  [FP-DBV0006A-MFG]

### Ports
CTRL (in), GND (in), VIN (in), VOUT (out)

### Nets
3V3: C11.2 U3.1(VIN) ; port VIN
GND: C11.1 C12.1 U3.2(GND) ; port GND
NetC12_2: C12.2 U3.4(CT)
NetR12_1: U3.6(VOUT) ; port VOUT
NetU3_3: U3.3(EN/UVLO) ; port CTRL

Not connected (* = marked no-connect by the designer): U3 5(QOD)

### Notes on the sheet
- QOD can be left floating as no discharging is needed

### Library data of the parts
C11 = CMP-03020-034654-1: CAP CER 10UF 10V X5R 0603; RoHS Compliant: Yes
C12 = CMP-03020-014723-2: CAP CER 100PF 16V NP0 0603; Manufacturer: KEMET; Automotive Grade: Grade 1; Material: Ceramic; Temperature Characteristic: C0G; Temperature Coefficient: 30ppm/°C; Tolerance: 0.1; Category: Cap; Temperature Range High: +125°C; RoHS: TRUE; Device Class L2: Capacitors; Automotive: Yes; Height: 0.87mm; Value: 100 pF; ComponentLink2Description: Datasheet; Digikey Description: CAP CER 100PF 16V NP0 0603; Manufacturer Part Number: C0603C101K4GAC7867; ComponentLink2URL: https://api.kemet.com/component-edge/download/datasheet/C0603C100J5GACAUTO.pdf; Device Class L1: Passive Components; Device Class L3: Ceramic Capacitors; Temperature: -55°C to +125°C; Lead Free: Yes; Capacitance: 100 pF; Temperature Range Low: -55°C; Voltage Rating: 16 V; Package: C0603C-CF; Octopart: https://octopart.com/c0603c101k4gac7867-kemet-1494535
U3 = CMP-04910-000007-2: IC PWR SWITCH N-CHAN 1:1 SOT23-6; Max Output Current: 2A; Max Supply Voltage: 18V; Min Supply Voltage: 2.7V; Number of Outputs: 1; Output Configuration: High Side; Fault Protection: Over Temperature; Interface: On/Off; Weight: 0.000801oz; Case/Package: SOT-23-6; Series: TPS22810-Q1; Package Quantity: 3000; RoHS Compliant: Yes; Number of Channels: 1; Max Operating Temperature: 105°C; Packaging: Cut Tape; Min Operating Temperature: -40°C

## Sheet Boost 5V.SchDoc
size A; SheetNumber: 12; SheetTotal: 12
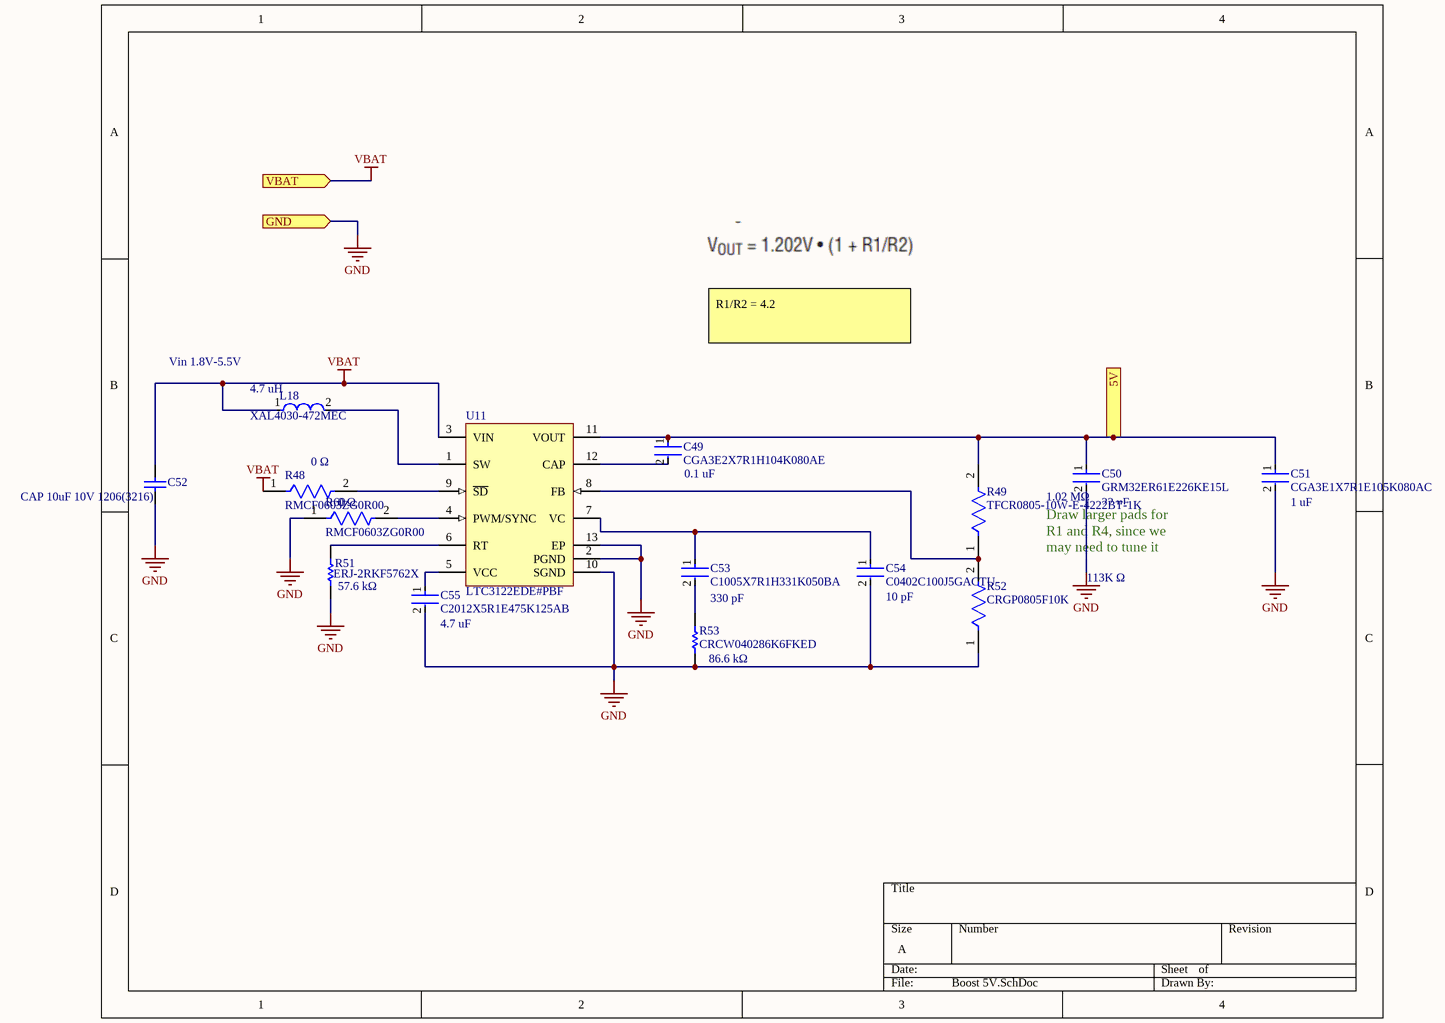
[diagram p5: Boost 5V.SchDoc]

### Parts
C49  CGA3E2X7R1H104K080AE  [FP-CGA3E-0_3-0_1-IPC_A]
C50  GRM32ER61E226KE15L  [FP-GRM32-MFG]
C51  CGA3E1X7R1E105K080AC  [FP-CGA3E-0_3-0_1-IPC_A]
C52  CAP 10uF 10V 1206(3216)  [CAPC1206(3216)190_L]
C53  C1005X7R1H331K050BA  [FP-C1005-050-0_05-IPC_B]
C54  C0402C100J5GACTU  [FP-C0402-BB-MFG]
C55  C2012X5R1E475K125AB  [FP-C2012-125-0_2-MFG]
L18  XAL4030-472MEC  [FP-XAL4030-472MEC-MFG]
R48  RMCF0603ZG0R00  [FP-RMCF0603-IPC_B]
R49  TFCR0805-10W-E-4222BT-1K  [FP-TFCR0805-IPC_A]
R51  ERJ-2RKF5762X  [RESC1005X40X25NL05T05]
R52  CRGP0805F10K  [FP-CRGP0805-IPC_C]
R53  CRCW040286K6FKED  [RESC1005X40X25NL05T05]
R60  RMCF0603ZG0R00  [FP-RMCF0603-IPC_B]
U11  LTC3122EDE#PBF  [LT-DE-UE-12_V]

### Ports
5V (out), GND (in), VBAT (in)

### Nets
5V0: C49.1 C50.1 C51.1 R49.2 U11.11(VOUT) ; port 5V
GND: C50.2 C51.2 C52.1 C54.2 C55.2 R51.1 R52.1 R53.1 R60.1 U11.2(PGND) U11.10(SGND) U11.13(EP) ; port GND
VBAT: C52.2 L18.1 R48.1 U11.3(VIN) ; port VBAT
NetC49_2: C49.2 U11.12(CAP)
NetC53_1: C53.1 C54.1 U11.7(VC)
NetC53_2: C53.2 R53.2
NetC55_1: C55.1 U11.5(VCC)
NetL18_2: L18.2 U11.1(SW)
NetR48_2: R48.2 U11.9(~{SD})
NetR49_1: R49.1 R52.2 U11.8(FB)
NetR51_2: R51.2 U11.6(RT)
NetR60_2: R60.2 U11.4(PWM/SYNC)

### Notes on the sheet
- Vin 1.8V-5.5V
- R1/R2 = 4.2
- (near L18) 4.7 uH
- (near R48) 0 Ω
- 0 Ω
- (near C49) 0.1 uF
- (near C50) 1.02 MΩ
- (near C50) 22 uF
- (near C51) 1 uF
- (near C50) Draw larger pads for R1 and R4, since we may need to tune it
- (near R51) 57.6 kΩ
- (near C55) 4.7 uF
- 330 pF
- (near C54) 10 pF
- 113K Ω
- (near R53) 86.6 kΩ

### Library data of the parts
C49 = CMP-08246-002410-1: Cap Ceramic 100nF 50V X7R 10% Pad SMD 0603 +125°C Automotive T/R; Thickness: 0.035inch; Dielectric: X7R; Height: 0.8mm; Min Operating Temperature: -55°C; Package Quantity: 4000; Voltage Rating: 50V; Voltage Rating (DC): 50V; Lead Free: Lead Free; Case Code (Metric): 1608; Ratings: AEC-Q200; Capacitance: 100nF; Length: 0.063inch; Width: 0.8mm; Weight: 7.1E-05oz; Case/Package: 0603; Case Code (Imperial): 0603; Termination: SMD/SMT; Mount: Surface Mount; Packaging: Tape and Reel; Max Operating Temperature: 125°C; Tolerance: 10%; Features: Soft Termination
C50 = CMP-2000-05458-2: CAP CER 22UF 25V X5R 1210; Manufacturer: Murata Electronics North America; Possible Substitute: GRM32ER61E226KE15K; Other Names: 490-3889-2; Material: Ceramic; Tolerance: 10%; Digikey Description: CAP CER 22UF 25V X5R 1210; Mouser Description: Multilayer Ceramic Capacitors MLCC - SMD/SMT 1210 22uF 25volts X5R 10%; Device Class L2: Capacitors; Height: 2.7mm; Temperature Characteristic: X5R; Category: Cap; RoHS: TRUE; Operating Temperature: -55°C ~ 85°C; Temperature: -55°C to +85°C; Lead Free: Yes; Package: GRM32; Temperature Range High: +85°C; Package / Case: 1210 (3225 Metric); Standard Package: 1,000; Packaging: Cut Tape (CT); Capacitance: 22uF; Thickness (Max): 0.106" (2.70mm); Value: 22uF; Automotive: No; Device Class L1: Passive Components; Voltage - Rated: 25V; Temperature Range Low: -55°C; Size / Dimension: 0.126" L x 0.098" W (3.20mm x 2.50mm); ComponentLink2Description: Datasheet; Device Class L3: Ceramic Capacitors; Temperature Coefficient: X5R; ComponentLink2URL: https://search.murata.co.jp/Ceramy/image/img/A01X/G101/ENG/GRM32ER61E226KE15-01A.pdf; Voltage Rating: 25V; Manufacturer Part Number: GRM32ER61E226KE15L; Octopart: https://octopart.com/grm32er61e226ke15l-murata-197441; Applications: General Purpose; Mounting Type: Surface Mount, MLCC
C51 = CMP-08246-001507-1: Cap Ceramic 1uF 25V X7R 10% Pad SMD 0603 +125°C Automotive T/R; Dielectric: X7R; Capacitance: 1uF; Voltage Rating: 25V; Thickness: 0.035inch; Width: 0.031inch; Ratings: AEC-Q200; Case Code (Metric): 1608; REACH SVHC: No SVHC; Voltage: 25V; Composition: Ceramic; Min Operating Temperature: -55°C; Termination: SMD/SMT; Depth: 0.8mm; Max Operating Temperature: 125°C; Mount: Surface Mount; Weight: 7.1E-05oz; Package Quantity: 4000; Tolerance: 10%; Packaging: Tape and Reel; Lead Free: Lead Free; Case/Package: 0603; Length: 1.6mm; Height: 0.8mm; Case Code (Imperial): 0603; Voltage Rating (DC): 25V
C52 = CMP-1037-04967-1: CAP 10uF 10V ±10% 1206 (3216 Metric) Thickness 1.9mm SMD; Tolerance: Â±10%; Case-Metric: 3216; Case-EIA: 1206; Rated Voltage: 10 V; Max Thickness: 1.9 mm; Technology: SMT; Value: 10uF
C53 = CMP-08246-002681-1: Multilayer Ceramic Capacitors 330pF ±10% 50V X7R SMD 0402; Height: 0.5mm; Min Operating Temperature: -55°C; Construction: Flat; Voltage Rating (DC): 50V; Depth: 0.5mm; Number of Pins: 2; Capacitance: 330pF; Case/Package: 0402; REACH SVHC: No SVHC; Lead Free: Lead Free; Thickness: 0.022inch; Package Quantity: 1; Case Code (Imperial): 0402; Max Operating Temperature: 125°C; RoHS Compliant: Yes; Voltage Rating: 50V; Length: 1mm; Weight: 2.3E-05oz; Width: 0.02inch; Case Code (Metric): 1005; Dielectric Material: Ceramic; Tolerance: 10%; Mount: Surface Mount; Dielectric: X7R; Series: C; Resistor Type: Ceramic; Termination: SMD/SMT; Packaging: Tape and Reel
C54 = CMP-2008-03404-2: Multilayer Ceramic Capacitor, C Series, 10 Pf, - 5%, C0G / Np0, 50 V, 0402 [1005 Metric] Rohs Compliant: Yes; Manufacturer: Kemet; Temperature Coefficient: 15%; Voltage Rating: 50 V; Capacitance: 10 pF; Value: 10 pF; Tolerance: 0.05; Automotive: No; Temperature Range High: +125°C; ComponentLink2Description: Datasheet; Manufacturer Part Number: C0402C100J5GACTU; Material: Ceramic; Lead Free: Yes; ComponentLink2URL: https://content.kemet.com/datasheets/KEM_C1002_X7R_SMD.pdf; Device Class L3: Ceramic Capacitors; RoHS: TRUE; Package: C0402-BB; Temperature: -55°C to +125°C; Temperature Range Low: -55°C; Height: 0.55mm; Mouser Description: Multilayer Ceramic Capacitor, C Series, 10 Pf, - 5%, C0G / Np0, 50 V, 0402 [1005 Metric] Rohs Compliant: Yes; Octopart: https://octopart.com/c0402c100j5gactu-kemet-108448; Digikey Description: Multilayer Ceramic Capacitor, C Series, 10 Pf, - 5%, C0G / Np0, 50 V, 0402 [1005 Metric] Rohs Compliant: Yes; Temperature Characteristic: C0G; Category: Cap; Ipc Land Pattern Name: CAPC10050X50; Device Class L1: Passive Components; Device Class L2: Capacitors
C55 = CMP-08246-004908-1: Multilayer Ceramic Capacitors 4.7μF ±10% 25V X5R SMD 0805; Capacitance: 4.7uF; Lead Free: Lead Free; Thickness: 0.057inch; Packaging: Tape and Reel; Min Operating Temperature: -55°C; RoHS Compliant: Yes; Dielectric: X5R; Weight: 0.000194oz; REACH SVHC: No SVHC; Voltage Rating (DC): 25V; Mount: Surface Mount; Resistor Type: Ceramic; Termination: SMD/SMT; Number of Pins: 2; Case Code (Imperial): 0805; Dielectric Material: Ceramic; Voltage: 25V; Voltage Rating: 25V; Case Code (Metric): 2012; Case/Package: 0805; Max Operating Temperature: 85°C; Height: 1.25mm; Tolerance: 10%; Depth: 1.25mm; Package Quantity: 1; Length: 2mm; Radiation Hardening: No; Width: 1.25mm
L18 = CMP-11268-000082-1: Power Inductor (SMD), 4.7 µH, 5.1 A, Shielded, 4.5 A, XAL40xx Series, 4mm x 4mm x 3.1mm; Tolerance: 20%; DC Resistance (DCR): 44.1mR; Inductance: 4.7uH; Saturation Current: 4.5A; Max DC Current: 5.1A; Self Resonant Frequency: 36MHz; Test Frequency: 100kHz; Core Material: Composite; REACH SVHC: No SVHC; Height: 3.1mm; Package Quantity: 500; Width: 4.3mm; Mount: Surface Mount; RoHS Compliant: Yes; Case/Package: SMD/SMT; Length: 4.3mm; Packaging: Tape and Reel; Max Operating Temperature: 125°C; Min Operating Temperature: -40°C; Series: XAL4030; Termination: SMD/SMT; Inductance Tolerance: 20%; Shielding: Shielded; RMS Current (Irms): 5.1A; Lead Free: Contains Lead
R48 R60 = CMP-26527-006412-1: as R9 on sheet System; Width: 0.031inch; RoHS Compliant: Yes; Number of Terminations: 2; Case/Package: 0603; Contact Plating: Tin; Height: 0.022inch; Resistor Type: Thick Film; Mount: Surface Mount; Length: 0.061inch; Features: Automotive AEC-Q200; Series: RMCF; Max Operating Temperature: 155°C; Radiation Hardening: No; Min Operating Temperature: -55°C; Packaging: Tape and Reel
R49 = CMP-250906-237835-1: RES Thin Film,  42.2kΩ, 0.1%, 0.1W, 25ppm/°C, 0805
R51 = CMP-2002-01001-1: Manufacturer: Panasonic; Part Number: ERJ-2RKF5762X
R52 = CMP-03211-006861-1: CRGP 0805 10K 1%; Manufacturer: TE; Power Rating: 0.33W; Voltage Rating: 150V; Value: 10KΩ; Tolerance: 0.01; Temperature Coefficient: ±100ppm/°C; Manufacturer Part Number: CRGP0805F10K; ComponentLink2URL: https://www.mouser.com/datasheet/2/418/NG_DS_9-1773463-9_A-1358566.pdf; Temperature Range Low: -55°C; Ipc Land Pattern Name: RESC200125X55; Device Class L2: Resistors; Automotive: No; Device Class L3: Chip SMD Resistors; Composition: Thick Film; Temperature Range High: +155°C; Temperature: -55°C to +155°C; Height: 0.65mm; Series: CRGP; RoHS: TRUE; Device Class L1: Passive Components; Octopart: https://octopart.com/crgp0805f10k-te+connectivity-91018782; Package: CRGP0805; Digikey Description: CRGP 0805 10K 1%; Ambient Temperature Range High: +70°C; Lead Free: Yes; ComponentLink2Description: Datasheet; Category: Res; Resistance: 10KΩ
R53 = CMP-2002-00247-1: Manufacturer: Vishay Dale; Part Number: CRCW040286K6FKED
U11 = CMP-0492-00369-1: 2.5 A Synchronous Step-Up DC/DC Converter with Output Disconnect, 12-pin SON (DE-UE-12), -40 to 125 degC, Pb-Free; Manufacturer: Linear Technology; Number of Outputs: 1; ComponentLink2URL: http://cds.linear.com/docs/en/datasheet/3122fa.pdf; ComponentLink1URL: http://www.linear.com/; Code_JEDEC: MO-229; ComponentLink2Description: Datasheet; ComponentLink1Description: Manufacturer URL; PackageReference: DE-UE-12; PackageVersion: Rev. D, 06/2010; ComponentLink3Description: Package Specification; PackageDescription: 12-Pin Plastic DFN, Body 4 x 3 mm, Pitch 0.5 mm; PartNumber: LTC3122EDE#PBF; ComponentLink3URL: http://cds.linear.com/docs/en/packaging/DFN_12_05-08-1695.pdf; Mounting Technology: Surface Mount; RoHS: TRUE; DatasheetVersion: Rev. A

## Nets that join several sheets
3V3: System (J2.9 R12.2), LDO (C20.2 U5.1 U5.2), Switch1 (C11.2 U3.1)
5V0: System (J2.8), PA stage 1 (R34.2), Boost 5V (5 pins)
GND: System (39 pins), PA stage 1 (8 pins), PA stage 2 (18 pins), LDO (C19.2 C20.1 U5.3 U5.7), Switch1 (C11.1 C12.1 U3.2), Boost 5V (12 pins)
VBAT: System (13 pins), LDO (C19.1 U5.5 U5.6), Boost 5V (C52.2 L18.1 R48.1 U11.3)
NetC35_1: System (R15.1), PA stage 1 (C35.1 U8.1)
NetJ4_1: System (J4.1 R54.1), PA stage 1 (R35.1), PA stage 2 (R43.2)
NetJ5_1: System (J5.1), PA stage 2 (R44.1 R46.2)
NetQ1_2: PA stage 1 (R39.2 R40.2), PA stage 2 (Q1.2)
NetR11_1: System (R11.1), PA stage 2 (R41.2 R42.2)
NetR12_1: System (R12.1), Switch1 (U3.6)
QOUT: System (J7.1 R13.2 R16.1 R54.2), PA stage 1 (R36.2 R38.2)